# Altium schematic sheet VALVEBOARD_Isolation.SchDoc
size A4; SheetNumber: 6; SheetTotal: 9
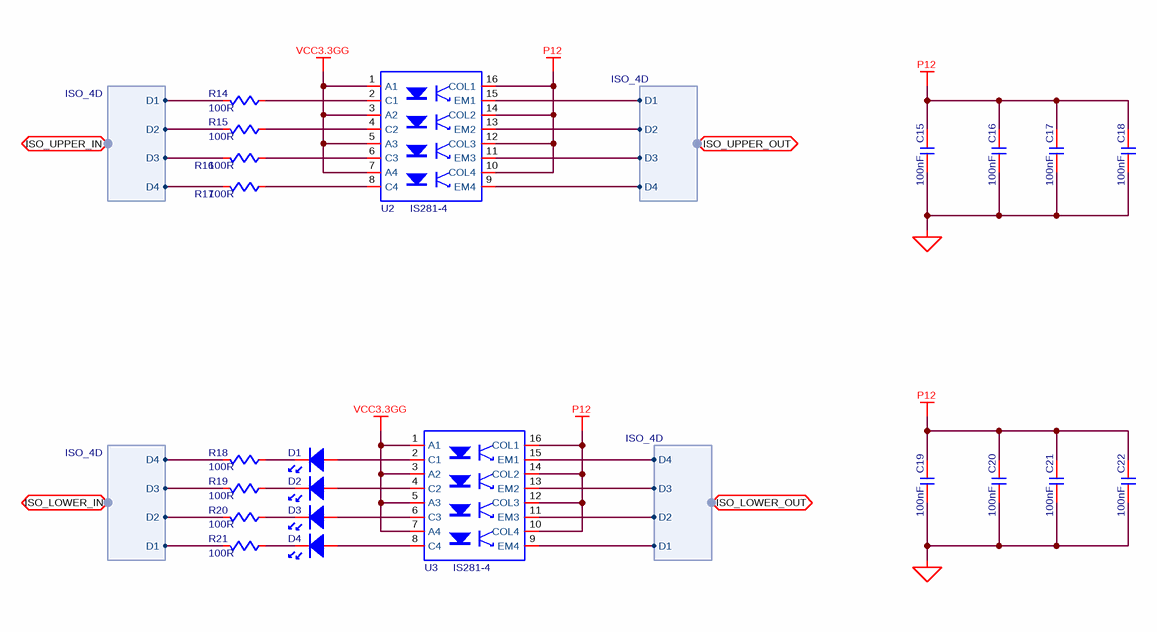
[diagram p0: VALVEBOARD_Isolation.SchDoc]

## Parts
C15  value 100nF  [C0603]  (hidden comment: C-NOMO)
C16  value 100nF  [C0603]  (hidden comment: C-NOMO)
C17  value 100nF  [C0603]  (hidden comment: C-NOMO)
C18  value 100nF  [C0603]  (hidden comment: C-NOMO)
C19  value 100nF  [C0603]  (hidden comment: C-NOMO)
C20  value 100nF  [C0603]  (hidden comment: C-NOMO)
C21  value 100nF  [C0603]  (hidden comment: C-NOMO)
C22  value 100nF  [C0603]  (hidden comment: C-NOMO)
D1  LED  [LED0603]  (value not drawn)
D2  LED  [LED0603]  (value not drawn)
D3  LED  [LED0603]  (value not drawn)
D4  LED  [LED0603]  (value not drawn)
R14  value 100R  [R0603]  (hidden comment: R)
R15  value 100R  [R0603]  (hidden comment: R)
R16  value 100R  [R0603]  (hidden comment: R)
R17  value 100R  [R0603]  (hidden comment: R)
R18  value 100R  [R0603]  (hidden comment: R)
R19  value 100R  [R0603]  (hidden comment: R)
R20  value 100R  [R0603]  (hidden comment: R)
R21  value 100R  [R0603]  (hidden comment: R)
U2  IS281-4  [PS2801]
U3  IS281-4  [PS2801]

## Ports
ISO_LOWER_IN (bidir, harness ISO_4D), ISO_LOWER_OUT (bidir, harness ISO_4D), ISO_UPPER_IN (bidir, harness ISO_4D), ISO_UPPER_OUT (bidir, harness ISO_4D)

## Harnesses
ISO_4D: D1, D2, D3, D4
ISO_4D: D4, D3, D2, D1

## Nets
P12: C15.2 C16.2 C17.2 C18.2 C19.2 C20.2 C21.2 C22.2 U2.10(COL4) U2.12(COL3) U2.14(COL2) U2.16(COL1) U3.10(COL4) U3.12(COL3) U3.14(COL2) U3.16(COL1)
PGND: C15.1 C16.1 C17.1 C18.1 C19.1 C20.1 C21.1 C22.1
VCC3.3GG: U2.1(A1) U2.3(A2) U2.5(A3) U2.7(A4) U3.1(A1) U3.3(A2) U3.5(A3) U3.7(A4)
NetD1_1: D1.1 R18.2
NetD1_2: D1.2 U3.2(C1)
NetD2_1: D2.1 R19.2
NetD2_2: D2.2 U3.4(C2)
NetD3_1: D3.1 R20.2
NetD3_2: D3.2 U3.6(C3)
NetD4_1: D4.1 R21.2
NetD4_2: D4.2 U3.8(C4)
NetR14_1: R14.1 ; port ISO_UPPER_IN.D1
NetR14_2: R14.2 U2.2(C1)
NetR15_1: R15.1 ; port ISO_UPPER_IN.D2
NetR15_2: R15.2 U2.4(C2)
NetR16_1: R16.1 ; port ISO_UPPER_IN.D3
NetR16_2: R16.2 U2.6(C3)
NetR17_1: R17.1 ; port ISO_UPPER_IN.D4
NetR17_2: R17.2 U2.8(C4)
NetR18_1: R18.1 ; port ISO_LOWER_IN.D4
NetR19_1: R19.1 ; port ISO_LOWER_IN.D3
NetR20_1: R20.1 ; port ISO_LOWER_IN.D2
NetR21_1: R21.1 ; port ISO_LOWER_IN.D1
NetU2_9: U2.9(EM4) ; port ISO_UPPER_OUT.D4
NetU2_11: U2.11(EM3) ; port ISO_UPPER_OUT.D3
NetU2_13: U2.13(EM2) ; port ISO_UPPER_OUT.D2
NetU2_15: U2.15(EM1) ; port ISO_UPPER_OUT.D1
NetU3_9: U3.9(EM4) ; port ISO_LOWER_OUT.D1
NetU3_11: U3.11(EM3) ; port ISO_LOWER_OUT.D2
NetU3_13: U3.13(EM2) ; port ISO_LOWER_OUT.D3
NetU3_15: U3.15(EM1) ; port ISO_LOWER_OUT.D4

## Library data of the parts
C15-C22 = C-NOMO: voltage: 25V; precision: 5%
R14-R21 = R: precision: 1%
U2 U3 = PS2801